# Altium schematic sheet HUSB337-SP1233原理图.SchDoc
size 635 x 533 mm
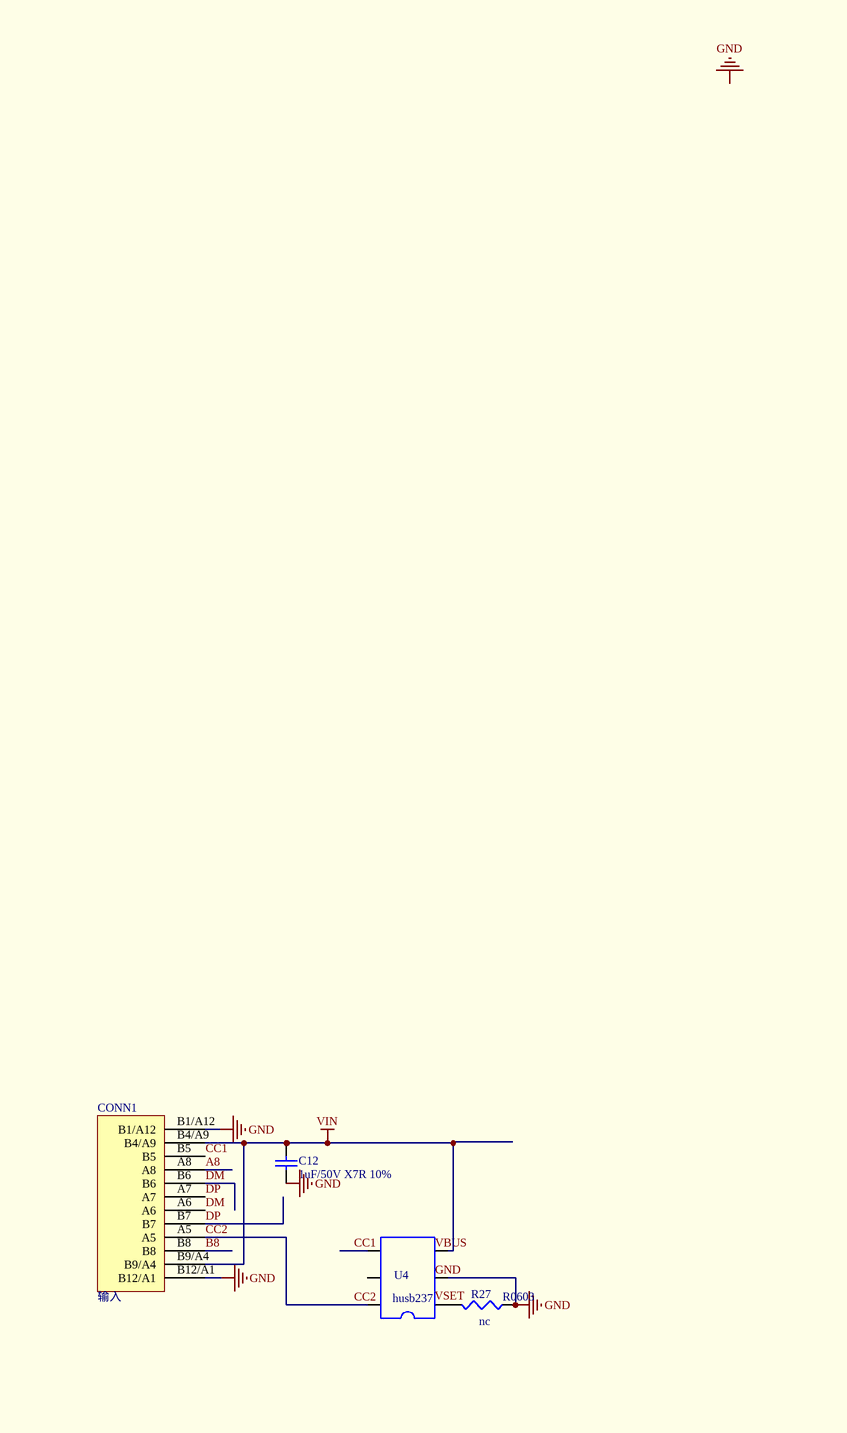
[diagram p0: HUSB337-SP1233原理图.SchDoc, top left]
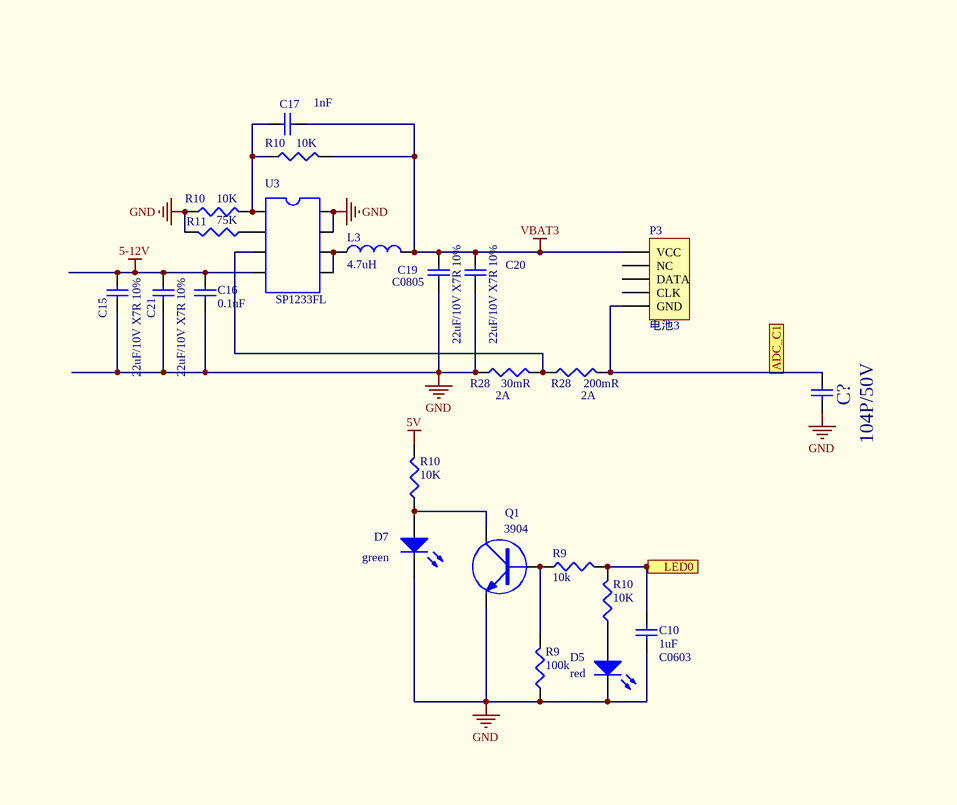
[diagram p1: HUSB337-SP1233原理图.SchDoc, top right]
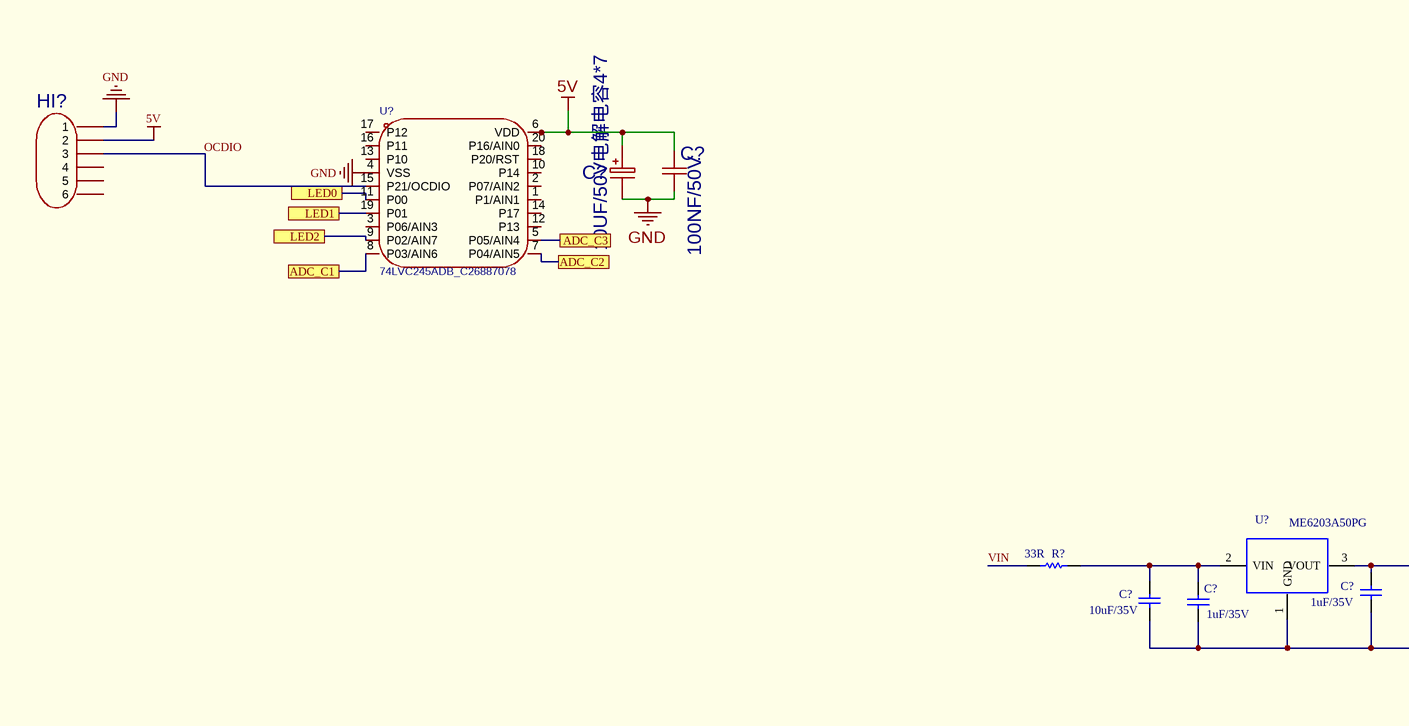
[diagram p2: HUSB337-SP1233原理图.SchDoc, bottom left]
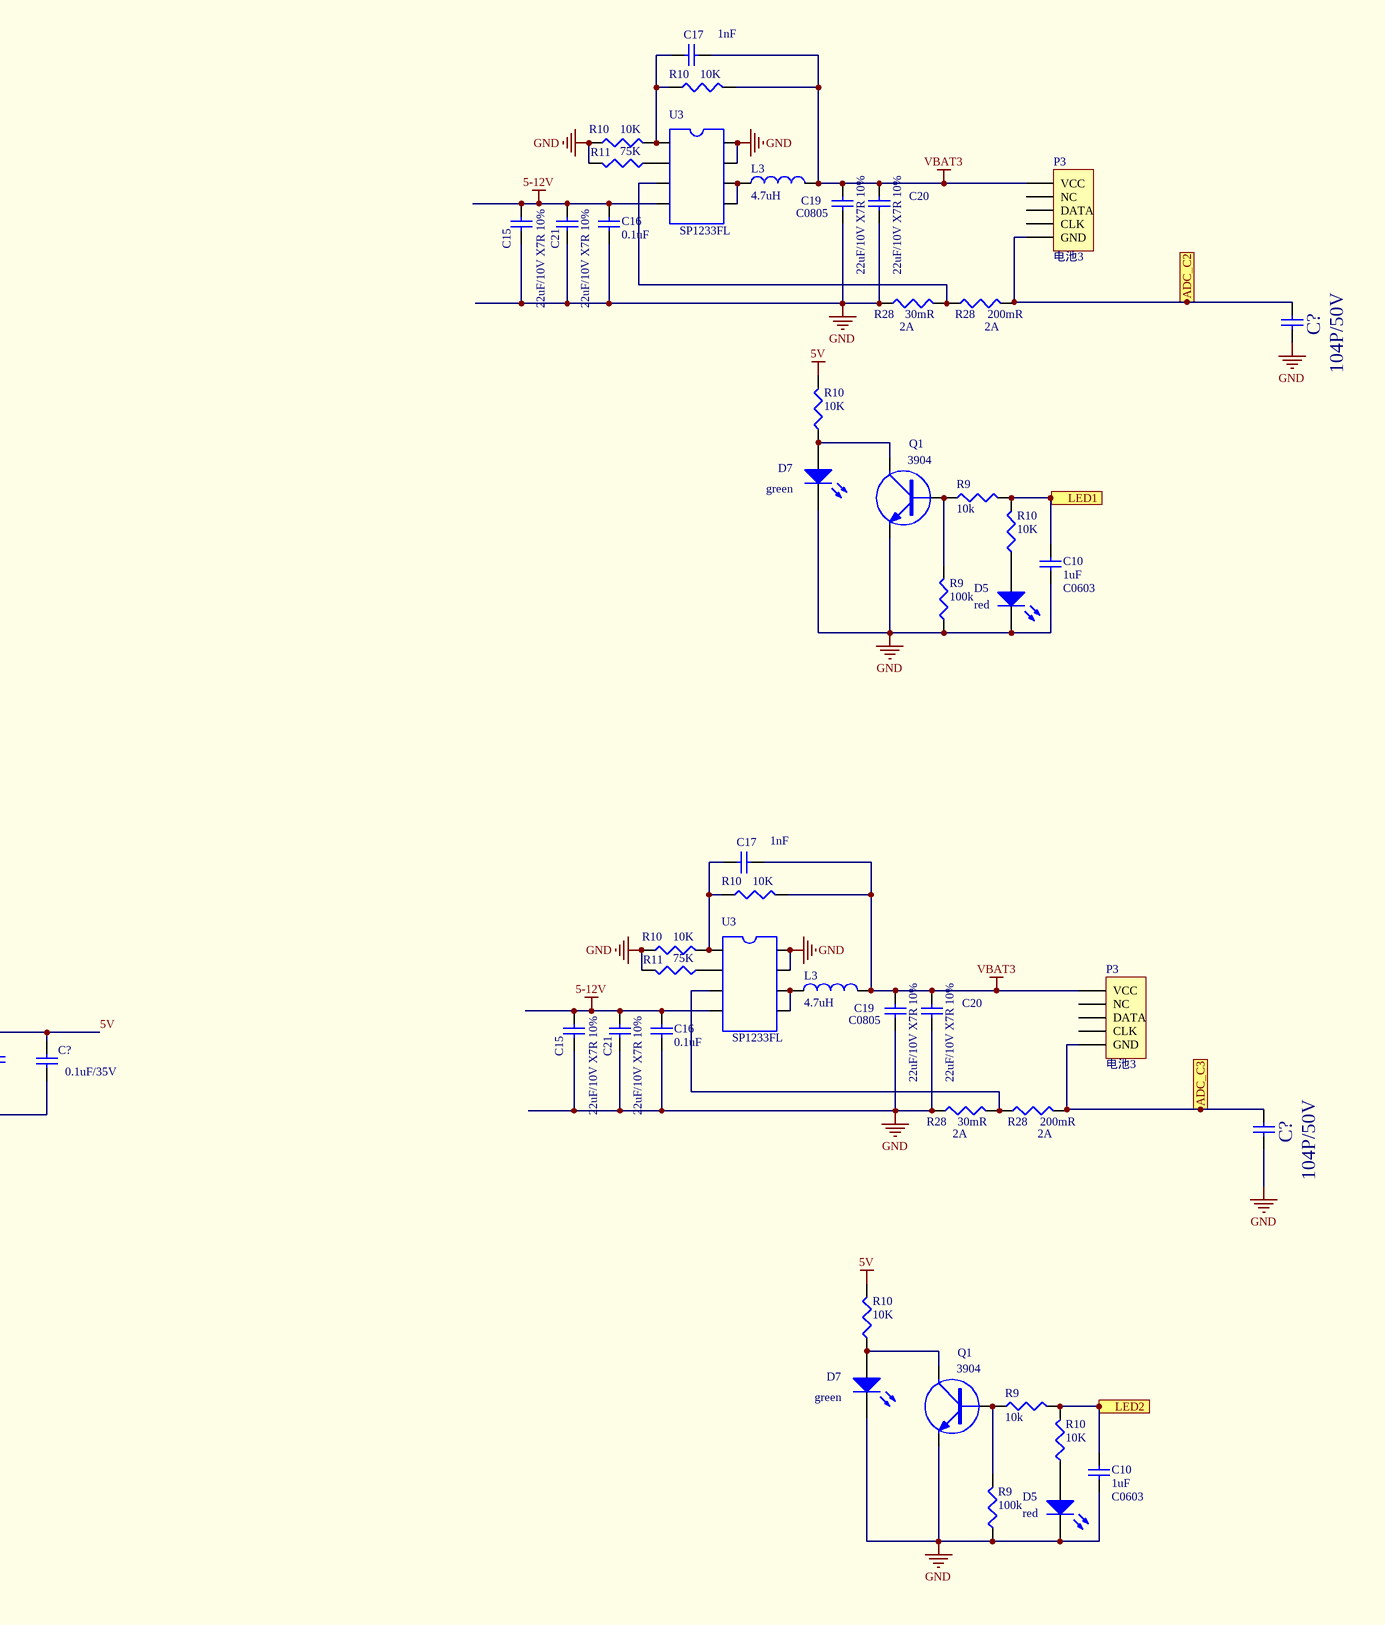
[diagram p3: HUSB337-SP1233原理图.SchDoc, bottom right]

## Parts
(Parts that share a designator on the sheet are numbered #1, #2 ... from top to bottom, then left to right.)
C10#1  1uF  value C0603  [SMD-C0805 锡膏]
C10#2  1uF  value C0603  [SMD-C0805 锡膏]
C10#3  1uF  value C0603  [SMD-C0805 锡膏]
C12  1uF/50V X7R 10%  [0603]
C15#1  22uF/10V X7R 10%  [SMD-C0805 锡膏]
C15#2  22uF/10V X7R 10%  [SMD-C0805 锡膏]
C15#3  22uF/10V X7R 10%  [SMD-C0805 锡膏]
C16#1  0.1uF  [0603]
C16#2  0.1uF  [0603]
C16#3  0.1uF  [0603]
C17#1  1nF  [0603]
C17#2  1nF  [0603]
C17#3  1nF  [0603]
C19#1  22uF/10V X7R 10%  value C0805  [SMD-C0805 锡膏]
C19#2  22uF/10V X7R 10%  value C0805  [SMD-C0805 锡膏]
C19#3  22uF/10V X7R 10%  value C0805  [SMD-C0805 锡膏]
C20#1  22uF/10V X7R 10%  [SMD-C0805 锡膏]
C20#2  22uF/10V X7R 10%  [SMD-C0805 锡膏]
C20#3  22uF/10V X7R 10%  [SMD-C0805 锡膏]
C21#1  22uF/10V X7R 10%  [SMD-C0805 锡膏]
C21#2  22uF/10V X7R 10%  [SMD-C0805 锡膏]
C21#3  22uF/10V X7R 10%  [SMD-C0805 锡膏]
C?#1  104P/50V  [0603]
C?#2  104P/50V  [0603]
C?#3  10UF/50V电解电容4*7  [ECAP-6.3*2.5]
C?#4  100NF/50V  [0603]
C?#5  1uF/35V  [C0603]
C?#6  0.1uF/35V  [C0603]
C?#7  10uF/35V  [C1206]
C?#8  1uF/35V  [C0603]
C?#9  104P/50V  [0603]
CONN1  输入  [SMD-TYPEC_16Pin 卧式]
D5#1  red  [3.2X1.6X1.1]
D5#2  red  [3.2X1.6X1.1]
D5#3  red  [3.2X1.6X1.1]
D7#1  green  [3.2X1.6X1.1]
D7#2  green  [3.2X1.6X1.1]
D7#3  green  [3.2X1.6X1.1]
HI?  (no value)
L3#1  4.7uH  [SMD-L WHC1040 锡膏]
L3#2  4.7uH  [SMD-L WHC1040 锡膏]
L3#3  4.7uH  [SMD-L WHC1040 锡膏]
P3#1  电池3  [电池座1]
P3#2  电池3  [电池座1]
P3#3  电池3  [电池座1]
Q1#1  3904
Q1#2  3904
Q1#3  3904
R9#1  10k  [0603]
R9#2  100k  [0603]
R9#3  10k  [0603]
R9#4  100k  [0603]
R9#5  10k  [0603]
R9#6  100k  [0603]
R10#1  10K  [0603]
R10#2  10K  [0603]
R10#3  10K  [0603]
R10#4  10K  [0603]
R10#5  10K  [0603]
R10#6  10K  [0603]
R10#7  10K  [0603]
R10#8  10K  [0603]
R10#9  10K  [0603]
R10#10  10K  [0603]
R10#11  10K  [0603]
R10#12  10K  [0603]
R11#1  75K  [0603]
R11#2  75K  [0603]
R11#3  75K  [0603]
R27  nc  Footprint: R0603  [0603]
R28#1  30mR  value 2A  [1206]
R28#2  200mR  value 2A  [1206]
R28#3  30mR  value 2A  [1206]
R28#4  200mR  value 2A  [1206]
R28#5  30mR  value 2A  [1206]
R28#6  200mR  value 2A  [1206]
R?  33R  [R1206]
U3#1  SP1233FL
U3#2  SP1233FL
U3#3  SP1233FL
U4  husb237  [SOT-23-5]
U?#1  74LVC245ADB_C26887078  [SSOP-20_L7.5-W5.2-P0.65-LS8.0-BL]
U?#2  ME6203A50PG  [SOT89]

## Ports
ADC_C1, ADC_C2, ADC_C3, LED0, LED1, LED2

## Nets
5-12V: C15#1.2 C15#2.2 C15#3.2 C16#1.1 C16#2.1 C16#3.1 C21#1.2 C21#2.2 C21#3.2 U3#1.4 U3#2.4 U3#3.4
5V: C?#3.1 C?#4.2 C?#5.2 C?#6.2 HI?.2 R10#3.2 R10#7.2 R10#11.2 U?#1.6(VDD) U?#2.3(VOUT)
GND: C10#1.2 C10#2.2 C10#3.2 C12.2 C15#1.1 C15#2.1 C15#3.1 C16#1.2 C16#2.2 C16#3.2 C19#1.1 C19#2.1 C19#3.1 C20#1.1 C20#2.1 C20#3.1 C21#1.1 C21#2.1 C21#3.1 C?#1.1 C?#2.1 C?#3.2 C?#4.1 C?#9.1 CONN1.B1/A12 CONN1.B12/A1 D5#1.2(K) D5#2.2(K) D5#3.2(K) D7#1.2(K) D7#2.2(K) D7#3.2(K) HI?.1 Q1#1.E Q1#2.E Q1#3.E R9#2.1 R9#4.1 R9#6.1 R10#2.1 R10#6.1 R10#10.1 R11#1.2 R11#2.2 R11#3.2 R27.1 R28#1.1 R28#3.1 R28#5.1 U3#1.7 U3#1.8 U3#2.7 U3#2.8 U3#3.7 U3#3.8 U4.2 U?#1.4(VSS)
VBAT3: C17#1.2 C17#2.2 C17#3.2 C19#1.2 C19#2.2 C19#3.2 C20#1.2 C20#2.2 C20#3.2 L3#1.2 L3#2.2 L3#3.2 P3#1.1(VCC) P3#2.1(VCC) P3#3.1(VCC) R10#1.2 R10#5.2 R10#9.2
VIN: C12.1 CONN1.B4/A9 CONN1.B9/A4 R?.2
A8: CONN1.A8
ADC_C1: U?#1.8(P03/AIN6) ; port ADC_C1
ADC_C2: C?#2.2 P3#2.5(GND) R28#4.2 U?#1.7(P04/AIN5) ; port ADC_C2
ADC_C3: C?#9.2 P3#3.5(GND) R28#6.2 U?#1.5(P05/AIN4) ; port ADC_C3
B8: CONN1.B8
CC1: CONN1.B5 U4.4
CC2: CONN1.A5 U4.6
DM: CONN1.A6 CONN1.B6
DP: CONN1.A7 CONN1.B7
LED0: C10#1.1 R9#1.2 R10#4.2 U?#1.11(P00) ; port LED0
LED1: C10#2.1 R9#3.2 R10#8.2 U?#1.19(P01) ; port LED1
LED2: C10#3.1 R9#5.2 R10#12.2 U?#1.9(P02/AIN7) ; port LED2
NetC17#1_1: C17#1.1 R10#1.1 R10#2.2 U3#1.1
NetC17#2_1: C17#2.1 R10#5.1 R10#6.2 U3#2.1
NetC17#3_1: C17#3.1 R10#9.1 R10#10.2 U3#3.1
NetC?#1_2: C?#1.2 P3#1.5(GND) R28#2.2
NetC?#5_1: C?#5.1 C?#6.1 C?#7.1 C?#8.1 U?#2.1(GND)
NetC?#7_2: C?#7.2 C?#8.2 R?.1 U?#2.2(VIN)
NetD5#1_1: D5#1.1(A) R10#4.1
NetD5#2_1: D5#2.1(A) R10#8.1
NetD5#3_1: D5#3.1(A) R10#12.1
NetD7#1_1: D7#1.1(A) Q1#1.C R10#3.1
NetD7#2_1: D7#2.1(A) Q1#2.C R10#7.1
NetD7#3_1: D7#3.1(A) Q1#3.C R10#11.1
NetHI?_3: HI?.3 U?#1.15(P21/OCDIO)
NetL3#1_1: L3#1.1 U3#1.5 U3#1.6
NetL3#2_1: L3#2.1 U3#2.5 U3#2.6
NetL3#3_1: L3#3.1 U3#3.5 U3#3.6
NetQ1#1_B: Q1#1.B R9#1.1 R9#2.2
NetQ1#2_B: Q1#2.B R9#3.1 R9#4.2
NetQ1#3_B: Q1#3.B R9#5.1 R9#6.2
NetR11#1_1: R11#1.1 U3#1.2
NetR11#2_1: R11#2.1 U3#2.2
NetR11#3_1: R11#3.1 U3#3.2
NetR27_2: R27.2 U4.1
NetR28#1_2: R28#1.2 R28#2.1 U3#1.3
NetR28#3_2: R28#3.2 R28#4.1 U3#2.3
NetR28#5_2: R28#5.2 R28#6.1 U3#3.3

Not connected (* = marked no-connect by the designer): HI? 4 5 6; P3#1 2(NC) 3(DATA) 4(CLK); P3#2 2(NC) 3(DATA) 4(CLK); P3#3 2(NC) 3(DATA) 4(CLK); U4 3 5; U?#1 1(P1/AIN1) 2(P07/AIN2) 3(P06/AIN3) 10(P14) 12(P13) 13(P10) 14(P17) 16(P11) 17(P12) 18(P20/RST) 20(P16/AIN0)

## Notes on the sheet
- Labels drawn without touching a wire or pin: GND, OCDIO, VBUS, VSET

## Library data of the parts
C10#1-C10#3 C15#1-C15#3 C16#1-C16#3 C17#1-C17#3 C19#1-C19#3 C20#1-C20#3 C21#1-C21#3 = CAP0603: Capacitor; Published: 8-Jun-2000; LatestRevisionDate: 17-Jul-2002; LatestRevisionNote: Re-released for DXP Platform.; PackageReference: RAD-0.3; Publisher: Altium Limited; PackageDescription: Radial Cap, Thru-Hole; 2 Leads; 0.3 in Pin Spacing
C12 = CAP0603: Capacitor; Value: 22uF/16V; Published: 8-Jun-2000; LatestRevisionDate: 17-Jul-2002; LatestRevisionNote: Re-released for DXP Platform.; PackageReference: RAD-0.3; Publisher: Altium Limited; PackageDescription: Radial Cap, Thru-Hole; 2 Leads; 0.3 in Pin Spacing
C?#1 C?#2 C?#9 = CAP0603: Capacitor; Value: 1uF/10V; Published: 8-Jun-2000; LatestRevisionDate: 17-Jul-2002; LatestRevisionNote: Re-released for DXP Platform.; PackageReference: RAD-0.3; Publisher: Altium Limited; PackageDescription: Radial Cap, Thru-Hole; 2 Leads; 0.3 in Pin Spacing
C?#3 = 10UF/50V电解电容4*7: Origin Footprint: 1206; UniqueId: 15f457d0e22dce27; SymbolName: ELECTRO; AddInBom: yes; Device: 10UF/50V电解电容4*7; DesignItemID: ELECTRO; LibraryName: sch; FootprintName: ECAP-6.3*2.5
C?#4 = 100NF/50V: UniqueId: b18536029b1a894b; SymbolName: CAP; AddInBom: yes; ModelId: f6fb33774f7b40b5b4606e3234dba389; Device: 100NF/50V; DesignItemID: CAP; LibraryName: sch; FootprintName: 0603; ModelName: 0603
C?#5-C?#8 = Cap: Capacitor; Value: 100pF; Published: 8-Jun-2000; LatestRevisionDate: 17-Jul-2002; LatestRevisionNote: Re-released for DXP Platform.; PackageReference: RAD-0.3; Publisher: Altium Limited
CONN1 = TYPC C
D5#1-D5#3 D7#1-D7#3 = LED2: Typical RED, GREEN, YELLOW, AMBER GaAs LED; Published: 8-Jun-2000; LatestRevisionDate: 17-Jul-2002; LatestRevisionNote: Re-released for DXP Platform.; PackageVersion: Feb-2002; PackageReference: 3.2X1.6X1.1; Publisher: Altium Limited; PackageDescription: SM LED; 2 Flat Leads
HI? = HI6: Header, 6-Pin; Origin Footprint: SIP5; UniqueId: c82c819d53d0542e; SymbolName: Header 6; AddInBom: yes; Device: HI6; LatestRevisionDate: 17-Jul-2002; LatestRevisionNote: Re-released for DXP Platform.; Publisher: Altium Limited; DesignItemID: Header 6; LibraryName: Miscellaneous Connectors
L3#1-L3#3 = INDUCTOR_SPM1010: INDUCTOR; Value: 4.7uH
P3#1-P3#3 = Header 5: Header, 5-Pin; LatestRevisionDate: 17-Jul-2002; LatestRevisionNote: Re-released for DXP Platform.; Publisher: Altium Limited
Q1#1-Q1#3 = NPN
R9#1 R9#3 R9#5 R10#1-R10#12 R28#1-R28#6 = RES_0603: Resistor
  R9#1 R9#3 R9#5: Value: 10K; Footprint: R0603
  R10#1-R10#12: Value: 10K
  R28#1-R28#6: Footprint: R1206
R9#2 R9#4 R9#6 = RES_0603: Resistor; Value: 10K; Footprint: R0603
R11#1-R11#3 R27 = RES_0603: Resistor; Value: 27K
R? = Res1: Resistor; Value: 33R/1206; Published: 8-Jun-2000; LatestRevisionDate: 17-Jul-2002; LatestRevisionNote: Re-released for DXP Platform.; PackageReference: AXIAL-0.3; Publisher: Altium Limited
U3#1-U3#3 = IC-8
U4 = IC-6
U?#1 = 74LVC245ADB_C26887078: AddInBom: yes; Device: 74LVC245ADB_C26887078; DesignItemID: 74LVC245ADB_C26887078; LibraryName: 74LVC245ADB_C26887078_2026-07-04; Symbol: 74LVC245ADB_C26887078; FootprintName: SSOP-20_L7.5-W5.2-P0.65-LS8.0-BL
U?#2 = LDO-7550: PCB DECAL: LC-SOT-89(SOT-89-3)